# Altium schematic sheet ECG_NEMO_final_V1B_main_stack2.schdoc
size A3
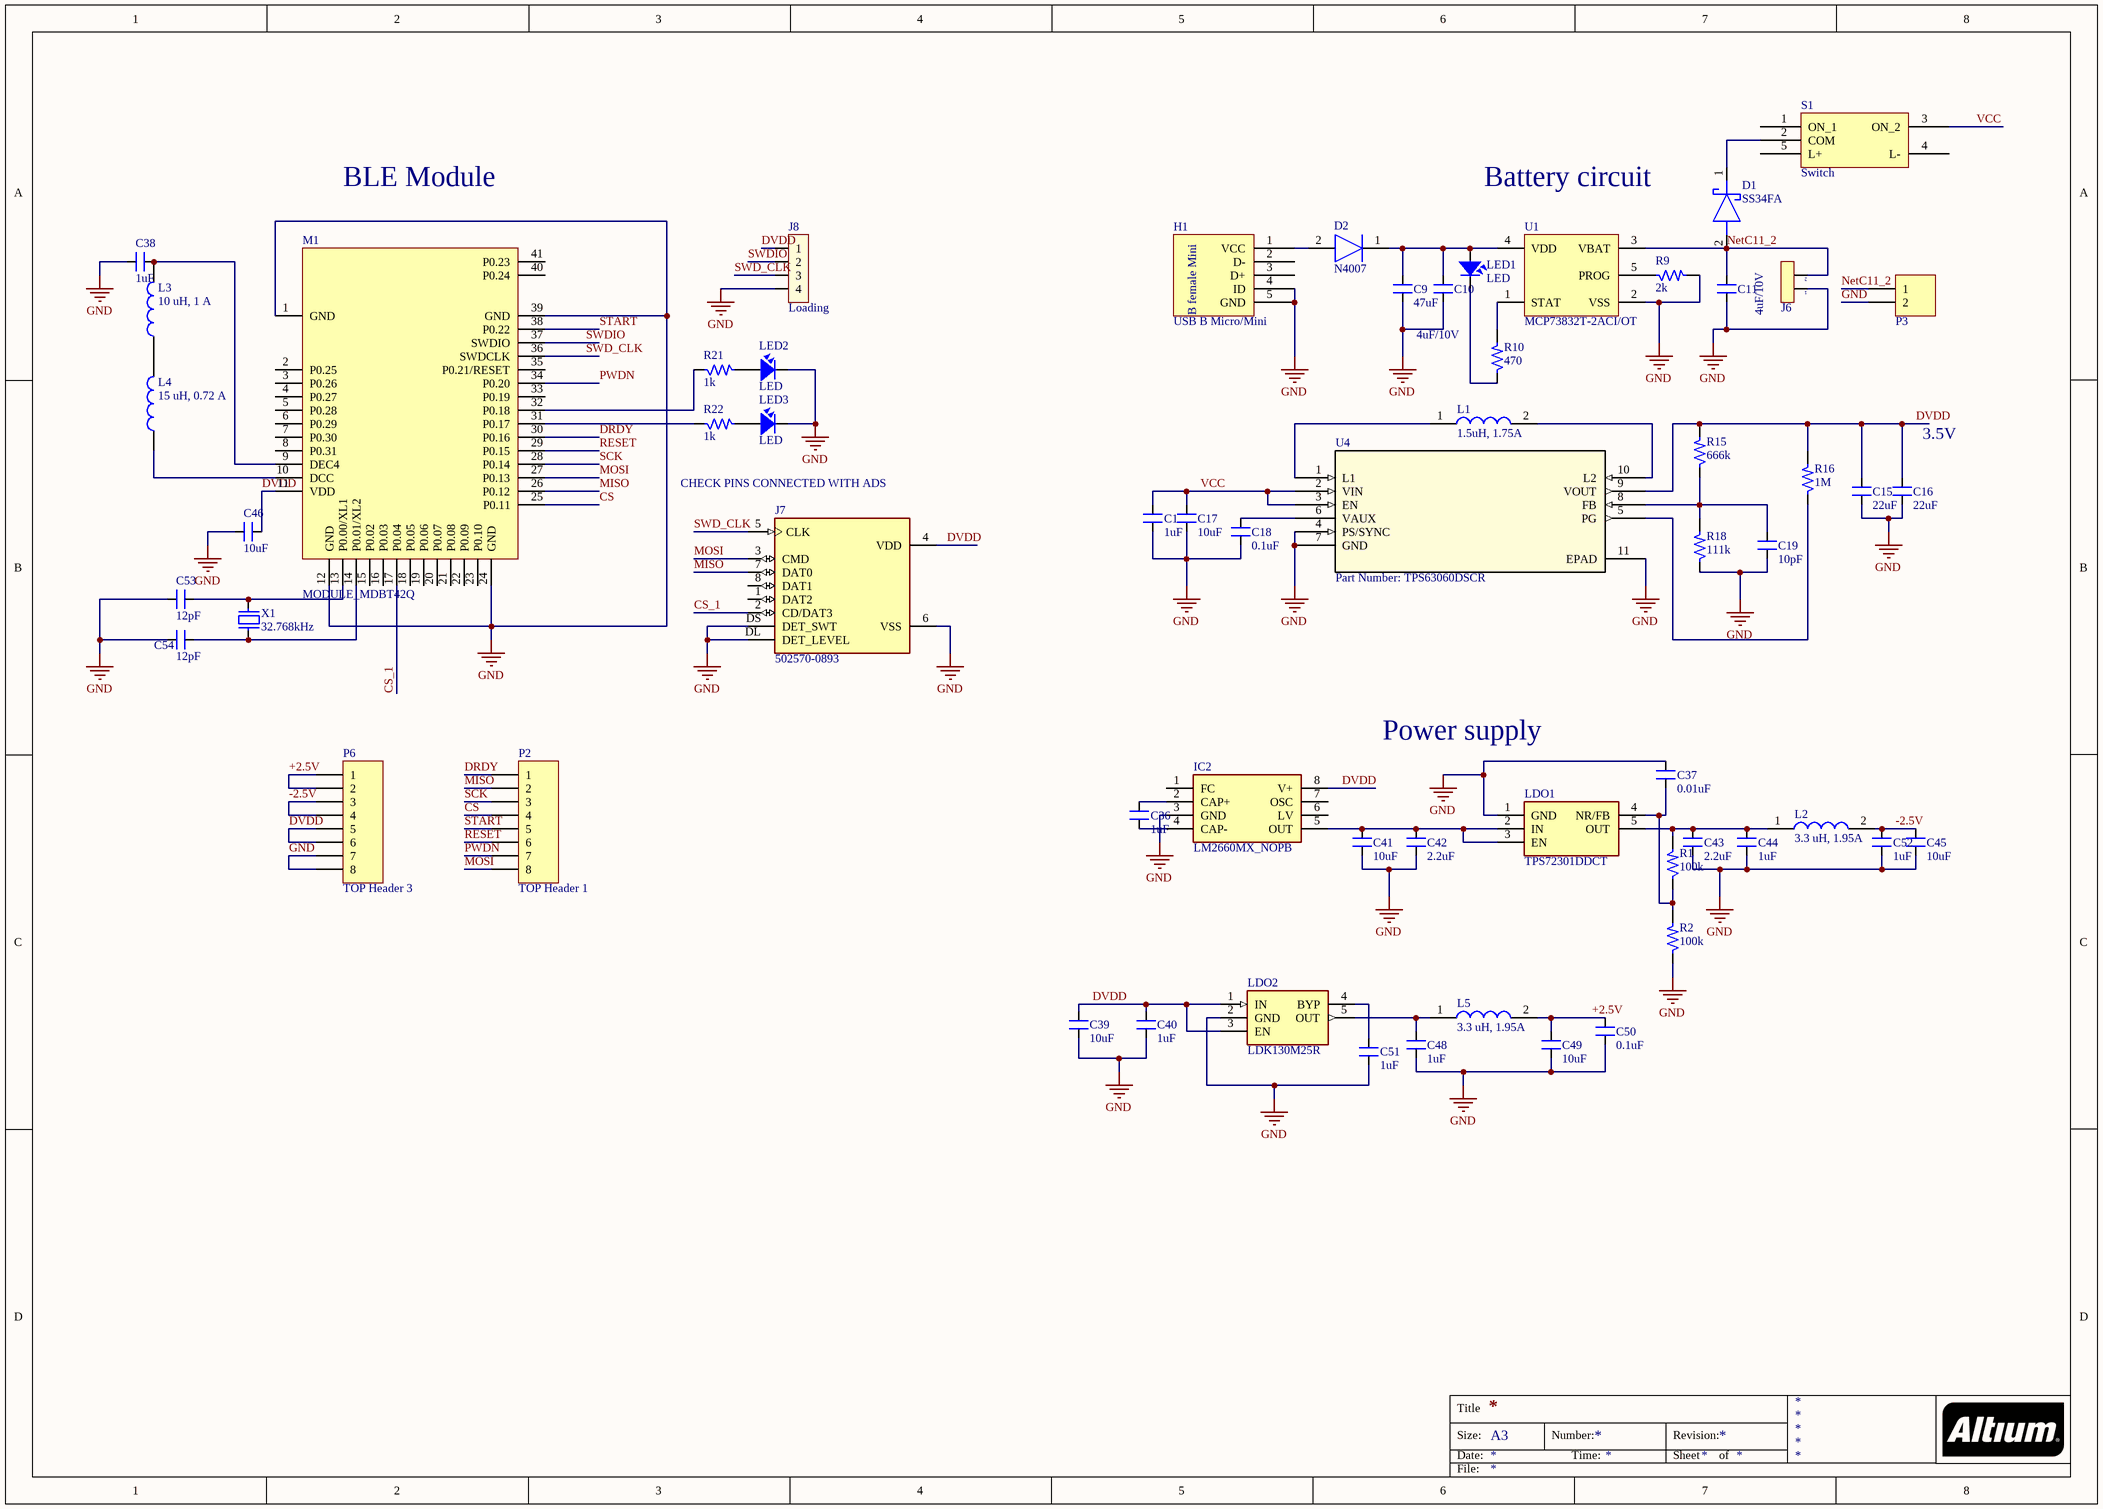
[diagram p0: ECG_NEMO_final_V1B_main_stack2.schdoc]

## Parts
C1  1uF  [SM-0805]
C9  47uF  [SM-0805]
C10  4uF/10V  [SM-0805]
C11  4uF/10V  [SM-0805]
C15  22uF  [SM-0805]
C16  22uF  [SM-0805]
C17  10uF  [SM-0805]
C18  0.1uF  [SM-0805]
C19  10pF  [SM-0805]
C36  1uF  [SM-0805]
C37  0.01uF  [SM-0805]
C38  1uF  [SM-0805]
C39  10uF  [SM-0805]
C40  1uF  [SM-0805]
C41  10uF  [SM-0805]
C42  2.2uF  [SM-0805]
C43  2.2uF  [SM-0805]
C44  1uF  [SM-0805]
C45  10uF  [SM-0805]
C46  10uF  [SM-0805]
C48  1uF  [SM-0805]
C49  10uF  [SM-0805]
C50  0.1uF  [SM-0805]
C51  1uF  [SM-0805]
C52  1uF  [SM-0805]
C53  12pF  [SM-0805]
C54  12pF  [SM-0805]
D1  SS34FA  [SODFL3618X143N]
D2  N4007  [DIOM5025X220N]
H1  USB B Micro/Mini  [USB-B-MICRO-female Tai02]
IC2  LM2660MX_NOPB  [SOIC127P600X175-8N]
J6  Jumper 2  [J2_Jst SH_1mm]  (value not drawn)
J7  502570-0893  [MOLEX_502570-0893]
J8  Loading  [sip4]
L1  1.5uH, 1.75A  [WE-TPC_381692]
L2  3.3 uH, 1.95A  [WE-TPC_4818/482892]
L3  10 uH, 1 A  [WE-TPC_2828]
L4  15 uH, 0.72 A  [WE-TPC_2828]
L5  3.3 uH, 1.95A  [WE-TPC_4818/482892]
LDO1  TPS72301DDCT  [SOT95P280X110-5N]
LDO2  LDK130M25R  [SOT95P280X145-5N]
LED1  LED  [SM-0805]
LED2  LED  [led0805]
LED3  LED  [led0805]
M1  MODULE_MDBT42Q  [PCB_MDBT42Q_10X16]
P2  TOP Header 1  [HDR1X8]
P3  Header 2  [JP2]  (value not drawn)
P6  TOP Header 3  [HDR1X8]
R1  100k  [SM-0805]
R2  100k  [SM-0805]
R9  2k  [SM-0805]
R10  470  [SM-0805]
R15  666k  [SM-0805]
R16  1M  [SM-0805]
R18  111k  [SM-0805]
R21  1k  [SM-0805]
R22  1k  [SM-0805]
S1  Switch  [SS12SDP2LC]
U1  MCP73832T-2ACI/OT  [SOT-23-OT5_N]
U4  Part Number: TPS63060DSCR  [DSC10_1P70X2P15]
X1  32.768kHz  [Crystal 32.768kHz SMD]

## Nets
GND: C1.1 C9.1 C10.1 C11.1 C15.1 C16.1 C17.1 C18.1 C19.1 C37.2 C38.1 C39.1 C40.1 C41.1 C42.1 C43.1 C44.1 C45.1 C46.1 C48.1 C49.1 C50.1 C51.1 C52.1 C53.1 C54.1 H1.4(ID) H1.5(GND) IC2.3(GND) J6.1 J7.6(VSS) J7.DL(DET_LEVEL) J7.DS(DET_SWT) J8.4 LDO1.1(GND) LDO2.2(GND) LED2.K LED3.K M1.1(GND) M1.12(GND) M1.24(GND) M1.39(GND) P3.2 P6.7 P6.8 R2.1 R9.2 R18.1 U1.2(VSS) U4.4(PS/SYNC) U4.7(GND) U4.11(EPAD)
+2.5V: C49.2 C50.2 L5.2 P6.1 P6.2
-2.5V: C45.2 C52.2 L2.2 P6.3 P6.4
CS: M1.25(P0.11) P2.4
CS_1: J7.2(CD/DAT3) M1.17(P0.04)
DRDY: M1.30(P0.16) P2.1
DVDD: C15.2 C16.2 C39.2 C40.2 C46.2 IC2.8(V+) J7.4(VDD) J8.1 LDO2.1(IN) LDO2.3(EN) M1.11(VDD) P6.5 P6.6 R15.2 R16.2 U4.9(VOUT)
MISO: J7.7(DAT0) M1.26(P0.12) P2.2
MOSI: J7.3(CMD) M1.27(P0.13) P2.8
NetC11_2: C11.2 D1.2(A) J6.2 P3.1 U1.3(VBAT)
PWDN: M1.34(P0.20) P2.7
RESET: M1.29(P0.15) P2.6
SCK: M1.28(P0.14) P2.3
START: M1.38(P0.22) P2.5
SWD_CLK: J7.5(CLK) J8.3 M1.36(SWDCLK)
SWDIO: J8.2 M1.37(SWDIO)
VCC: C1.2 C17.2 S1.3(ON_2) U4.2(VIN) U4.3(EN)
NetC9_2: C9.2 C10.2 D2.1(K) LED1.1 U1.4(VDD)
NetC18_2: C18.2 U4.6(VAUX)
NetC19_2: C19.2 R15.1 R18.2 U4.8(FB)
NetC36_1: C36.1 IC2.2(CAP+)
NetC36_2: C36.2 IC2.4(CAP-)
NetC37_1: C37.1 LDO1.4(NR/FB) R1.1 R2.2
NetC38_2: C38.2 L3.2 M1.9(DEC4)
NetC41_2: C41.2 C42.2 IC2.5(OUT) LDO1.2(IN) LDO1.3(EN)
NetC43_2: C43.2 C44.2 L2.1 LDO1.5(OUT) R1.2
NetC48_2: C48.2 L5.1 LDO2.5(OUT)
NetC51_2: C51.2 LDO2.4(BYP)
NetC53_2: C53.2 M1.13(P0.00/XL1) X1.2
NetC54_2: C54.2 M1.14(P0.01/XL2) X1.1
NetD1_1: D1.1(K) S1.2(COM)
NetD2_2: D2.2(A) H1.1(VCC)
NetL1_1: L1.1 U4.1(L1)
NetL1_2: L1.2 U4.10(L2)
NetL3_1: L3.1 L4.2
NetL4_1: L4.1 M1.10(DCC)
NetLED1_2: LED1.2 R10.1
NetLED2_A: LED2.A R21.2
NetLED3_A: LED3.A R22.2
NetM1_31: M1.31(P0.17) R22.1
NetM1_32: M1.32(P0.18) R21.1
NetR9_1: R9.1 U1.5(PROG)
NetR10_2: R10.2 U1.1(STAT)
NetR16_1: R16.1 U4.5(PG)

Not connected (* = marked no-connect by the designer): H1 2(D-) 3(D+); IC2 1(FC) 6(LV) 7(OSC); J7 1(DAT2) 8(DAT1); M1 2(P0.25) 3(P0.26) 4(P0.27) 5(P0.28) 6(P0.29) 7(P0.30) 8(P0.31) 15(P0.02) 16(P0.03) 18(P0.05) 19(P0.06) 20(P0.07) 21(P0.08) 22(P0.09) 23(P0.10) 33(P0.19) 35(P0.21/RESET) 40(P0.24) 41(P0.23); S1 1(ON_1) 4(L-) 5(L+)

## Notes on the sheet
- BLE Module
- (near D1) Battery circuit
- 3.5V
- CHECK PINS CONNECTED WITH ADS
- Power supply
- Title
- Size:
- Date:
- A3
- Number:
- Time:
- Revision:
- Sheet
- of
- File:
- (in symbol USB B Female Micro/Mini SMD) B female Mini

## Library data of the parts
C1 C9-C11 C15-C19 C36-C46 C48-C54 = CM: Cap SMD; Value: 103
D1 = SS34FA: Schottky Diode; Manufacturer_Name: ON Semiconductor; Datasheet Link: https://componentsearchengine.com/Datasheets/1/SS34FA.pdf; Height: 1.43mm; Mouser Part Number: 512-SS34FA; Mouser Price/Stock: https://www.mouser.com/Search/Refine.aspx?Keyword=512-SS34FA; Manufacturer_Part_Number: SS34FA
D2 = EC11FS2: Diode; Manufacturer_Name: KYOCERA; Datasheet Link: https://www.mouser.jp/datasheet/2/909/EC11FS2-file-1588983.pdf; Height: 2.2mm; Mouser Part Number: 346-EC11FS2; Manufacturer_Part_Number: EC11FS2
H1 = USB B Female Micro/Mini SMD
IC2 = LM2660MX_NOPB: Integrated Circuit; Manufacturer_Name: Texas Instruments; Manufacturer_Part_Number: LM2660MX NOPB; Datasheet Link: https://www.ti.com/lit/ds/symlink/lm2660.pdf?ts=1636191506646&ref_url=https%253A%252F%252Fwww.ti.com%252Fstore%252Fti%252Fen%252Fp%252Fproduct%252F%253Fp%253DLM2660MX%252FNOPB; Height: 1.75mm; Arrow Part Number: LM2660MX NOPB; Arrow Price/Stock: https://www.arrow.com/en/products/lm2660mxnopb/texas-instruments
J6 = JP 2: Value: JP 2
J7 = 502570-0893: 10 _8 + 2_ Position Card Connector Secure Digital - microSDâ„¢ Surface Mount, Right Angle Gold; MF: Molex; Price: None; Package: None; Value: *; MP: 502570-0893; Availability: Unavailable; SnapEDA_Link: https://www.snapeda.com/parts/502570-0893/Molex/view-part/225170/?ref=snap
J8 = JP4: Connector 4; Value: Connector 4x2
L1 = 744031001: Inductor; Manufacturer_Name: Wurth Elektronik; Manufacturer_Part_Number: 744031001; Mouser Part Number: 710-744031001; Mouser Price/Stock: https://www.mouser.co.uk/ProductDetail/Wurth-Elektronik/744031001?qs=PGXP4M47uW5omdHfp5PCig%3D%3D
L2 L5 = 744042003: Inductor; Manufacturer_Name: Wurth Elektronik; Manufacturer_Part_Number: 744042003; Mouser Part Number: 710-744042003; Mouser Price/Stock: https://www.mouser.co.uk/ProductDetail/Wurth-Elektronik/744042003?qs=PGXP4M47uW67fekbtUi6HQ%3D%3D
L3 = 744025100: SMT Shielded Tiny Power Inductor WE-TPC, size 2828, 10 uH, 1 A; Rated Current: 1 A; Inductance: 10 uH; DC Resistance max.: 190 mOhm; Self Resonant Frequency: 41 MHz; Saturation Current: 1.1 A; ComponentLink1Description: Manufacturer; ComponentLink1URL: http://www.we-online.de; ComponentLink2Description: Datasheet; ComponentLink2URL: https://katalog.we-online.com/pbs/datasheet/744025100.pdf; Part Number: 744025100; Published Date: December 2018; Publisher: Wurth Elektronik; Size: 2828; Operating Temperature: -40 to +125 degC; Mounting Technology: SMT; Packaging: Tape and Reel
L4 = 744025150: SMT Shielded Tiny Power Inductor WE-TPC, size 2828, 15 uH, 0.72 A; Rated Current: 0.72 A; Inductance: 15 uH; DC Resistance max.: 400 mOhm; Self Resonant Frequency: 32 MHz; Saturation Current: 0.9 A; ComponentLink1Description: Manufacturer; ComponentLink1URL: http://www.we-online.de; ComponentLink2Description: Datasheet; ComponentLink2URL: https://katalog.we-online.com/pbs/datasheet/744025150.pdf; Part Number: 744025150; Published Date: December 2018; Publisher: Wurth Elektronik; Size: 2828; Operating Temperature: -40 to +125 degC; Mounting Technology: SMT; Packaging: Tape and Reel
LDO1 = TPS72301DDCT: Integrated Circuit; Manufacturer_Name: Texas Instruments; Datasheet Link: http://www.ti.com/lit/gpn/TPS723; Height: 1.1mm; Manufacturer_Part_Number: TPS72301DDCT; Mouser Part Number: 595-TPS72301DDCT; Mouser Price/Stock: https://www.mouser.co.uk/ProductDetail/Texas-Instruments/TPS72301DDCT?qs=7z%252BmIopC6%2FL7xVbTZrmV7g%3D%3D; Arrow Part Number: TPS72301DDCT; Arrow Price/Stock: https://www.arrow.com/en/products/tps72301ddct/texas-instruments?region=nac
LDO2 = LDK130M25R: Integrated Circuit; Manufacturer_Name: STMicroelectronics; Datasheet Link: http://www.st.com/web/en/resource/technical/document/datasheet/DM00076097.pdf; Height: 1.45mm; Manufacturer_Part_Number: LDK130M25R; Mouser Part Number: 511-LDK130M25R; Mouser Price/Stock: https://www.mouser.com/Search/Refine.aspx?Keyword=511-LDK130M25R; Arrow Part Number: LDK130M25R; Arrow Price/Stock: https://www.arrow.com/en/products/ldk130m25r/stmicroelectronics
LED1-LED3 = LED: LED Single colour Green and Red; Value: LED 3 ly Single Colour
M1 = MODULE_MDBT42Q: MDBT42Q
P2 P6 = Header 8: Header, 8-Pin; LatestRevisionDate: 17-Jul-2002; LatestRevisionNote: Re-released for DXP Platform.; Publisher: Altium Limited
P3 = Header 2: Header, 2-Pin; LatestRevisionDate: 17-Jul-2002; LatestRevisionNote: Re-released for DXP Platform.; Publisher: Altium Limited
R1 R2 R9 R10 R15 R16 R18 R21 R22 = R: Resistor 1/4W; Value: R1/4W - 1K
S1 = SS12SDP2LC
U1 = MCP73832T-2ACI/OT: Miniature Single-Cell, Fully Integrated Li-Ion, Li-Polymer Charge Management Controller, 4.2V, 5-Pin SOT-23, Industrial Temperature, Tape and Reel; Published: 29-Jan-2009; LatestRevisionDate: 27-Nov-2009; LatestRevisionNote: Updated to datasheet revision E, Sep-2008; DatasheetVersion: revE, Sep-2008; PackageVersion: revBB, Aug-2009; PackageReference: SOT-23-OT5; Publisher: Altium Limited; PackageDescription: 5-Lead Plastic Small Outline Transistor (OT) [SOT-23]; Supplier 1: Digi-Key; Supplier Part Number 1: MCP73832T-2ACI/OTTR-ND; Supplier 2: Digi-Key; Supplier Part Number 2: MCP73832T-2ACI/OTCT-ND; Supplier 3: Digi-Key; Supplier Part Number 3: MCP73832T-2ACI/OTDKR-ND; Supplier 4: Farnell; Supplier Part Number 4: 1332159; Code_IPC: SOT23-5; ComponentLink1Description: Datasheet; ComponentLink1URL: http://ww1.microchip.com/downloads/en/DeviceDoc/21984e.pdf; ComponentLink2Description: Packaging Specification; ComponentLink2URL: http://www.microchip.com/stellent/groups/techpub_sg/documents/packagingspec/en012702.pdf; ComponentLink3Description: Microchip.com Home; ComponentLink3URL: http://www.microchip.com/
U4 = TPS63060DSCR: No Description Available; Vendor: Texas Instruments; Built_By: EMA_UL_Team; Manufacturer_Part_Number: TPS63060DSCR; Manufacturer: Texas Instruments; Copyright: Copyright (C) 2018 Accelerated Designs. All rights reserved; RefDes: RefDes; Type: DEV; Value: Value
X1 = Crystal: Crystal For all Crystal 2pin.; Value: 4Mhz